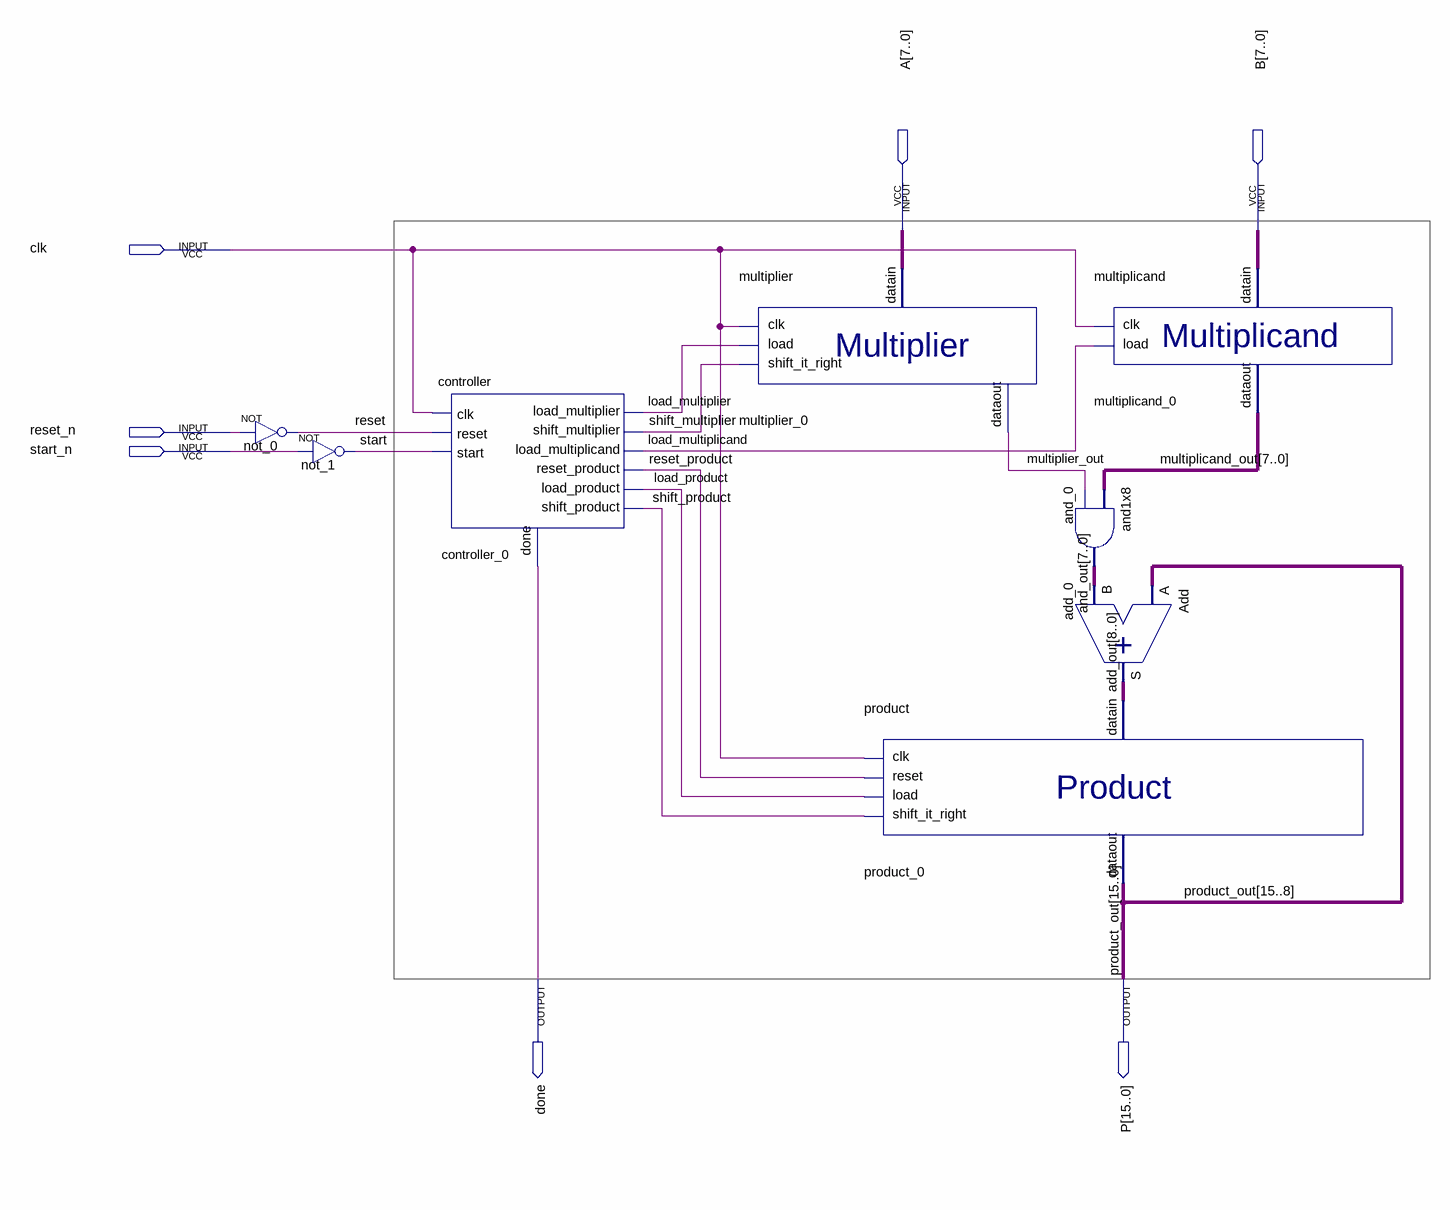
[diagram p0: schematic sheet]
// Quartus schematic Multiplier_8bits.bdf as structural Verilog: 8 symbols, 7 pins
module Multiplier_8bits (
  input  [7:0] A,
  input  [7:0] B,
  input  clk,
  input  reset_n,
  input  start_n,
  output done,
  output [15:0] P
);

  wire load_multiplicand, load_multiplier, load_product, multiplier_out, reset, reset_product,
       shift_multiplier, shift_product, start;
  wire [7:0] and_out, multiplicand_out;
  wire [8:0] add_out;

  not not_0 (reset, reset_n);
  not not_1 (start, start_n);
  controller controller_0 (
    .clk(clk), .start(start), .reset(reset), .done(done), .load_multiplier(load_multiplier),
    .shift_multiplier(shift_multiplier), .load_multiplicand(load_multiplicand),
    .reset_product(reset_product), .load_product(load_product), .shift_product(shift_product));
  multiplier multiplier_0 (
    .clk(clk), .load(load_multiplier), .datain(A), .shift_it_right(shift_multiplier), .dataout(multiplier_out));
  product product_0 (
    .clk(clk), .load(load_product), .datain(add_out), .reset(reset_product), .shift_it_right(shift_product),
    .dataout(P));
  and1x8 and_0 (.a(multiplier_out), .b(multiplicand_out), .s(and_out));
  Add add_0 (.a(P[15:8]), .b(and_out), .s(add_out));
  multiplicand multiplicand_0 (.clk(clk), .load(load_multiplicand), .datain(B), .dataout(multiplicand_out));

  // Other names for the same wires on the sheet: product_out[15:0] = P
endmodule
